# EAGLE design EAGLE FILE (EAGLE 6.6.0)
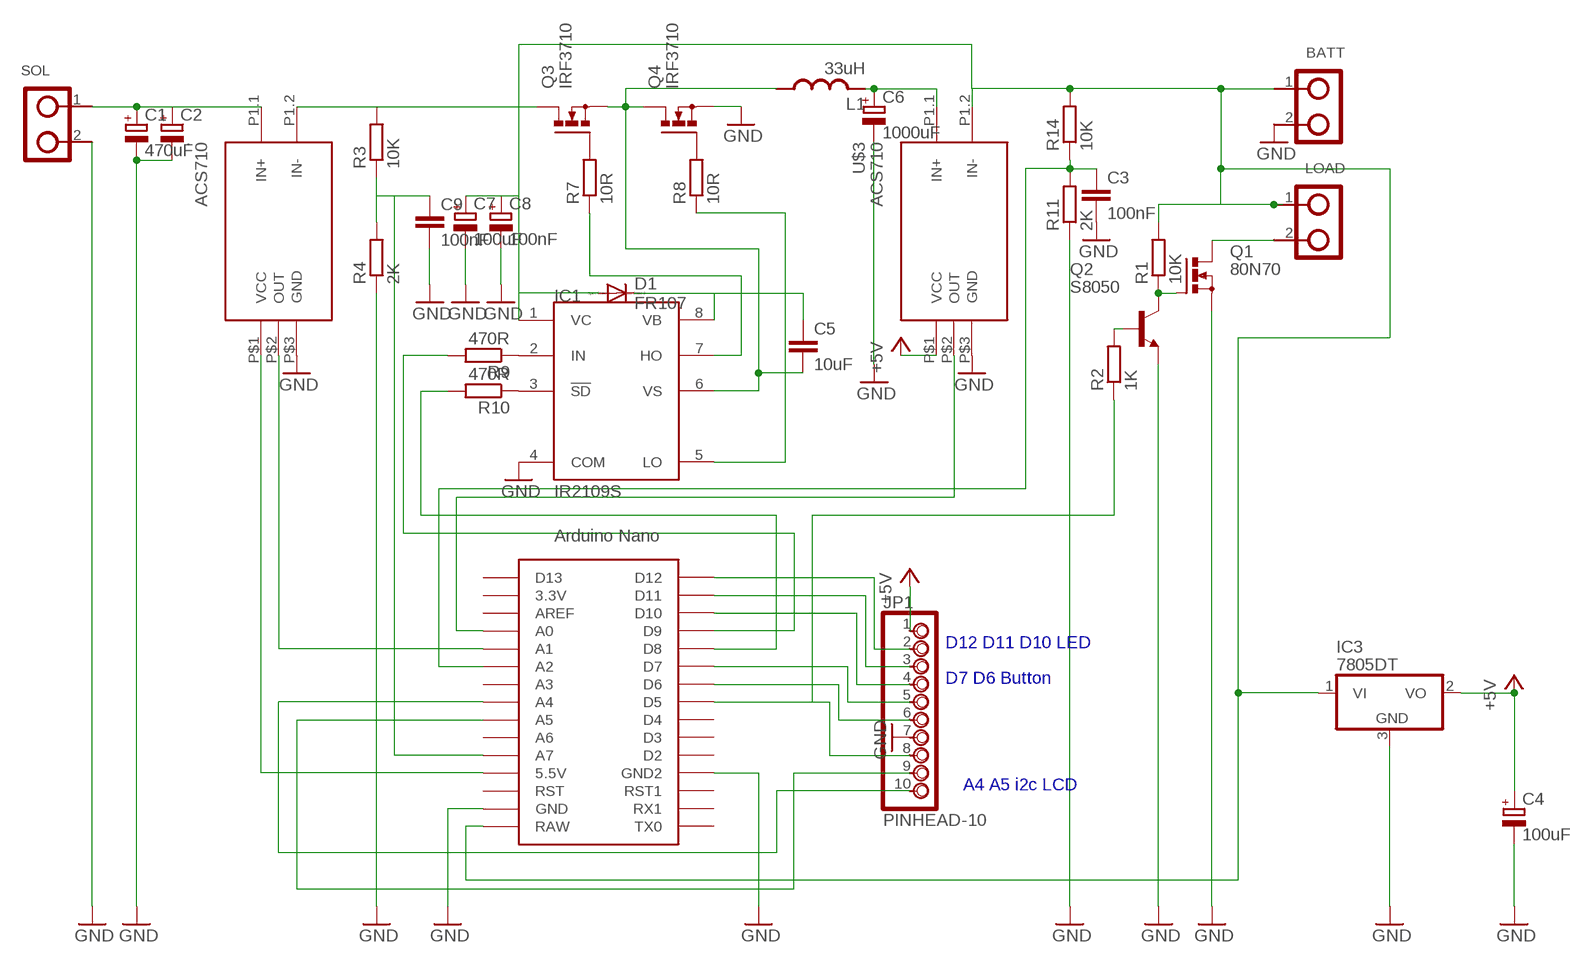
[diagram p0: schematic, sheet 1]

## Parts
.  ACS710  CURRENT-SENSOR-ACS712#IC  [CURRENT-SENSOR-ACS712#IC]
BATT  DOMINO-2  [DOMI-2]
C1  470uF  CPOL-EUE5-13  [E5-13]
C2  CPOL-EUE5-13  [E5-13]
C3  100nF  C-EUC1206  [C1206]
C4  100uF  CPOL-EUSMCD  [SMC_D]
C5  10uF  C-EUC1812  [C1812]
C6  1000uF  CPOL-EUE5-13  [E5-13]
C7  100uF  CPOL-EUSMCD  [SMC_D]
C8  100nF  CPOL-EUSMCD  [SMC_D]
C9  100nF  C-EUC1206  [C1206]
D1  FR107  DIODE-SMB  [SMB]
IC1  IR2109S  [SO08]
IC3  7805DT  [TO252]
JP1  PINHEAD-10  [PINHEAD-10]
L1  33uH  L-10  [L-10]
LOAD  DOMINO-2  [DOMI-2]
Q1  80N70  IRF512  [TO220BV]
Q2  S8050  2N4416  [TO92]
Q3  IRF3710  IRF512  [TO220BV]
Q4  IRF3710  IRF512  [TO220BV]
R1  10K  R-EU_R1206  [R1206]
R2  1K  R-EU_R1206  [R1206]
R3  10K  R-EU_R1206  [R1206]
R4  2K  R-EU_R1206  [R1206]
R7  10R  R-EU_R1206  [R1206]
R8  10R  R-EU_R1206  [R1206]
R9  470R  R-EU_R1206  [R1206]
R10  470R  R-EU_R1206  [R1206]
R11  2K  R-EU_R1206  [R1206]
R14  10K  R-EU_R1206  [R1206]
SOL  DOMINO-2  [DOMI-2]
U$1  NANO  [NANO]
U$3  ACS710  CURRENT-SENSOR-ACS712#IC  [CURRENT-SENSOR-ACS712#IC]

## Nets
+5V: C4.+ IC3.2(VO) JP1.1 U$3.P$1(VCC)
GND: ..P$3(GND) BATT.2 C1.- C2.- C3.2 C4.- C6.- C7.- C8.- C9.2 IC1.4(COM) IC3.3(GND) JP1.7 Q1.S Q2.3(E) Q4.S R4.1 R11.1 SOL.2 U$1.GND U$1.GND1(GND2) U$3.P$3(GND)
N$1: ..P$1(VCC) U$1.5V(5.5V)
N$2: LOAD.2 Q1.D
N$3: Q1.G Q2.1(C) R1.1
N$4: Q2.2(B) R2.2
N$5: JP1.8 R2.1 U$1.D5
N$6: ..P1.1(IN+) C1.+ C2.+ SOL.1
N$7: ..P1.2(IN-) Q3.D R3.2
N$8: ..P$2(OUT) U$1.A1
N$10: C9.1 R3.1 R4.2 U$1.A7
N$11: JP1.5 U$1.D7
N$12: JP1.6 U$1.D6
N$13: JP1.2 U$1.D12
N$14: JP1.3 U$1.D11
N$15: JP1.4 U$1.D10
N$17: Q3.G R7.2
N$18: Q4.G R8.2
N$19: IC1.7(HO) R7.1
N$20: IC1.5(LO) R8.1
N$21: IC1.2(IN) R9.1
N$22: IC1.3(!SD) R10.1
N$23: R9.2 U$1.D9
N$24: R10.2 U$1.D8
N$25: U$1.A0 U$3.P$2(OUT)
N$26: C3.1 R11.2 R14.1 U$1.A2
N$27: C6.+ L1.2 U$3.P1.1(IN+)
N$31: JP1.10 U$1.A4
N$32: JP1.9 U$1.A5
VB: C5.1 D1.C IC1.8(VB)
VCCS: BATT.1 C7.+ C8.+ D1.A IC1.1(VC) IC3.1(VI) LOAD.1 R1.2 R14.2 U$1.RAW U$3.P1.2(IN-)
VS: C5.2 IC1.6(VS) L1.1 Q3.S Q4.D
Unconnected: U$1.3.3V U$1.A3 U$1.A6 U$1.AREF U$1.D2 U$1.D3 U$1.D4 U$1.D13 U$1.RST U$1.RST1 U$1.RX1 U$1.TX0

## Notes on the sheet
- D12 D11 D10 LED
- D7 D6 Button
- A4 A5 i2c LCD

## Library data of the parts
. U$3 = diy-modules:CURRENT-SENSOR-ACS712#IC: Isolated Bipolar Current Sensors based on ACS712 chip Symbol with input pins More details available here: http://embedded-lab.com/blog/a-brief-overview-of-allegro-acs712-current-sensor-part-1/ Click here to find device on ebay.com <http://www.ebay.com/sch/acs712+module> Note: There are many available versions with different pinout. Please check before use
BATT LOAD SOL = HungLBR:DOMINO-2
C1 C2 C6 = lbr:CPOL-EU: POLARIZED CAPACITOR, European symbol
C3 C5 C9 = rcl:C-EU: CAPACITOR, European symbol
C4 C7 C8 = rcl:CPOL-EU: POLARIZED CAPACITOR, European symbol
D1 = diode:DIODE-: DIODE
IC1 = irs:IR2109
IC3 = chuong:78*: Positive VOLTAGE REGULATOR Source: http://cache.national.com/ds/LM/LM78L05.pdf http://www.fairchildsemi.com/ds/LM/LM7805.pdf
JP1 = chuong:PINHEAD-10
L1 = lbr:L-10
Q1 Q3 = chuong:IRF512: N-CHANNEL MOS FET
Q2 = lbr:2N4416: NPN Transistor
Q4 = lbr:IRF512: N-CHANNEL MOS FET
R1-R4 R7-R11 R14 = rcl:R-EU_: RESISTOR, European symbol
U$1 = Arduino-clone:NANO: Arduino Nano

## Board
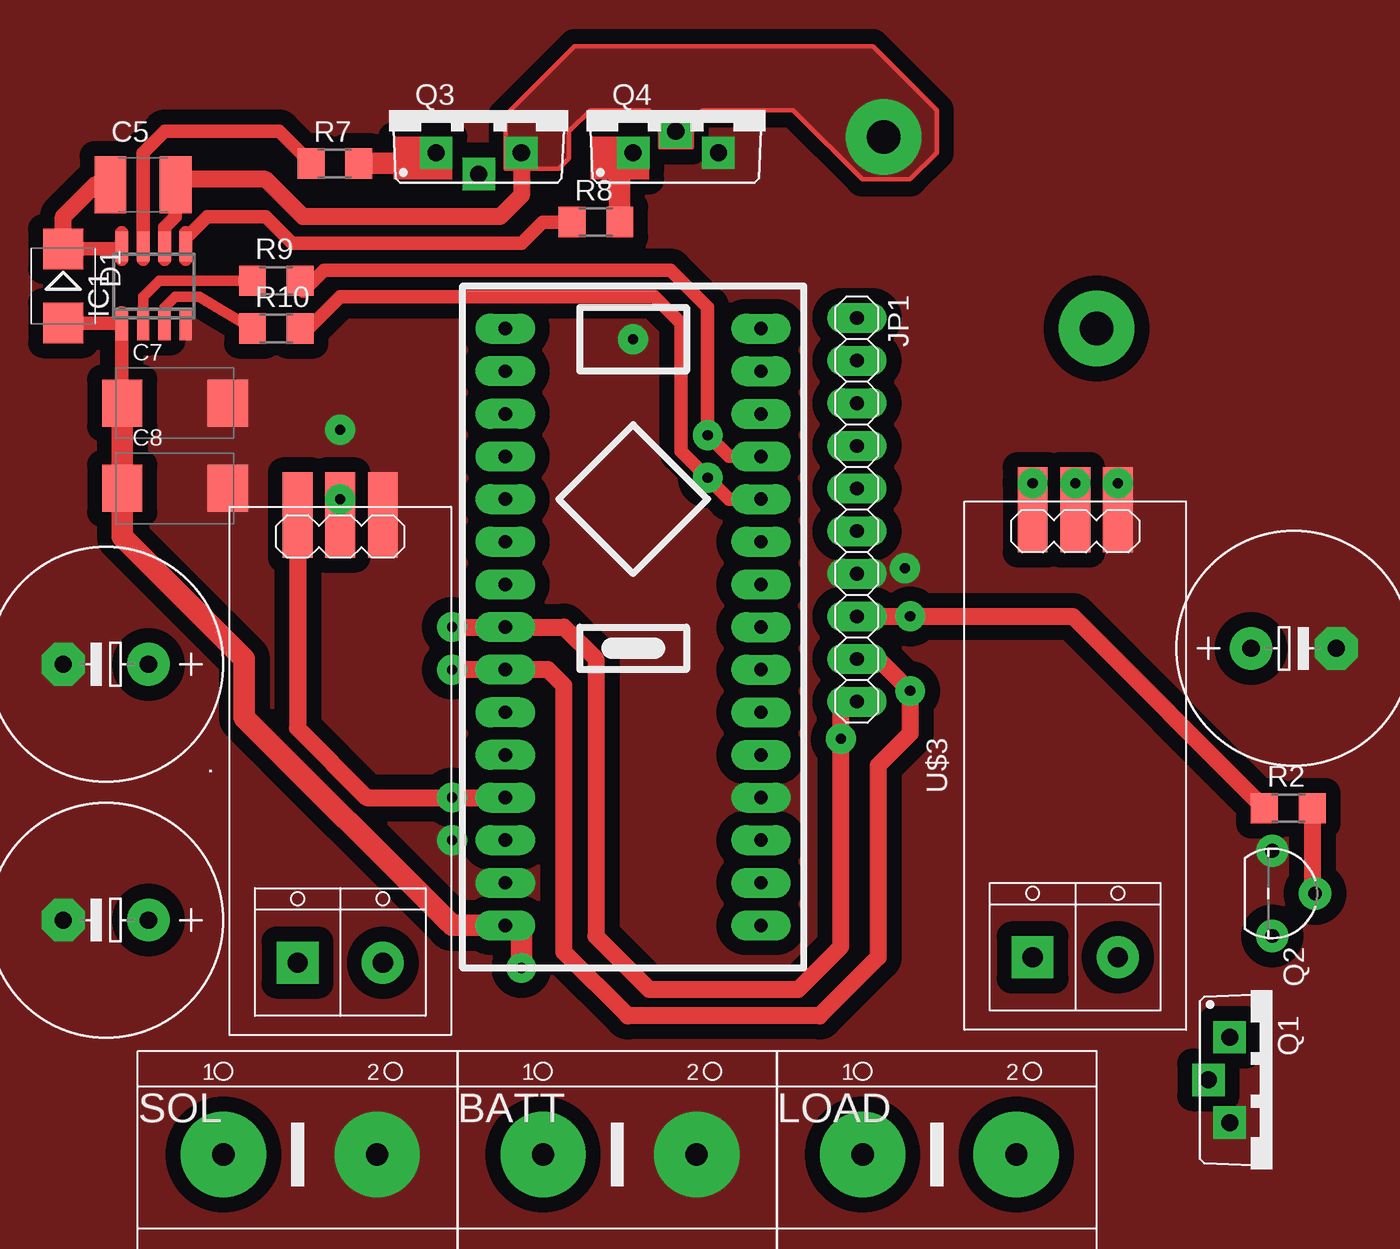
[diagram p1: board, top side]
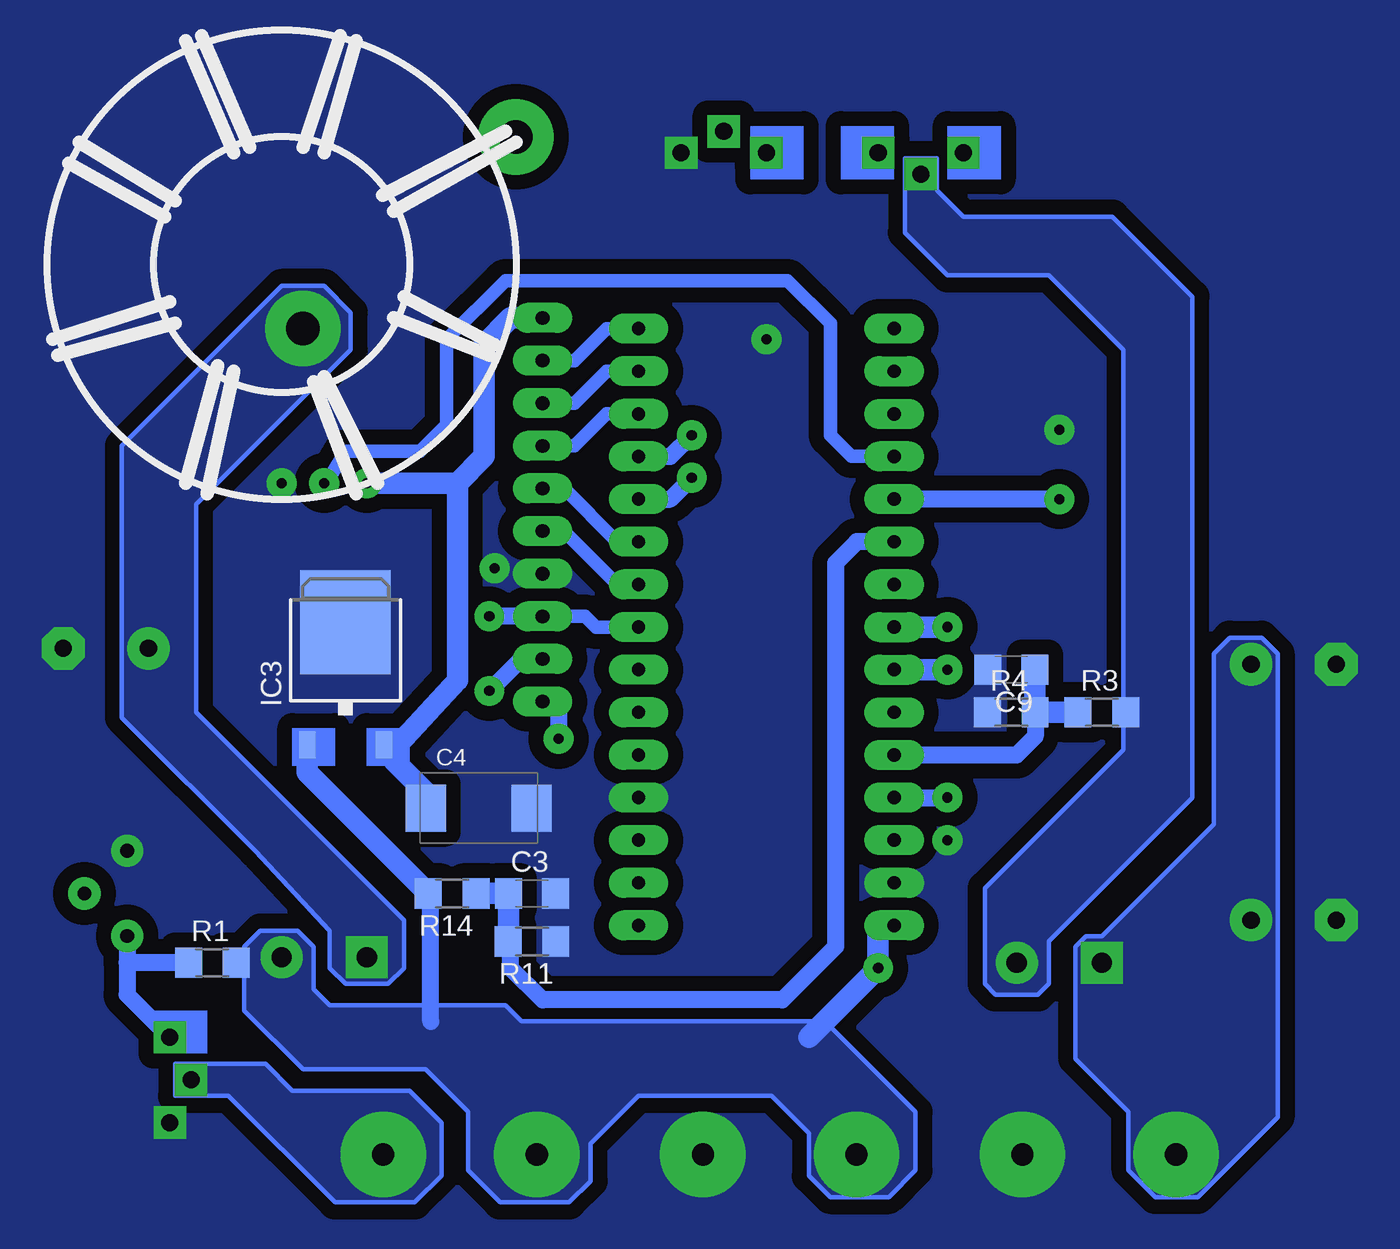
[diagram p2: board, bottom side, seen from below]

No outline drawn. Coordinates in mm, seen from the top.
Copper layers (1*16): Top 0.035mm / dielectric 1.5mm / Bottom 0.035mm
Design rules "default": minimum track width 10mil, minimum drill 24mil, track to track 8mil, track to pad 8mil, pad to pad 8mil, via to via 8mil, smd to smd 8mil, copper to edge 40mil, drill to drill 8mil, minimum pad ring 10mil, minimum via ring 8mil, stop-mask expansion 4mil, vias tented up to drill 0mil, thermal gap 10mil

### Footprints (pad centres in the part's own frame; a part is rotated, then mirrored left to right if it is on the bottom)
CURRENT-SENSOR-ACS712#IC = drill 1.2 pad 2.5 square: P1.1 -11.43,2.54 | drill 1.2 pad 2.5: P1.2 -11.43,-2.54 | smd 5.08 x 1.778: P$1 15.24,2.54; P$2 15.24,0; P$3 15.24,-2.54
DOMI-2 = drill 1.321 pad 5.08: 1 0.025,2.54; 2 9.182,2.54
E5-13 = drill 1.016 pad 2.54: + -2.54,0 | drill 1.016 pad 2.54 octagon: - 2.54,0
C1206 = smd 1.6 x 1.8: 1 -1.4,0; 2 1.4,0
SMC_D = smd 2.4 x 2.8: + -3.15,0; - 3.15,0
C1812 = smd 1.9 x 3.4: 1 -1.95,0; 2 1.95,0
SMB = smd 2.4 x 2.4: A 2.2,0; C -2.2,0
SO08 = smd 0.72 x 1.78: 1 -1.905,-2.35; 2 -0.635,-2.35; 3 0.635,-2.35; 4 1.905,-2.35; 5 1.905,2.35; 6 0.635,2.35; 7 -0.635,2.35; 8 -1.905,2.35
TO252 = smd 1 x 1.6: 1 -2.28,-4.8; 2 2.28,-4.8 | smd 5.4 x 6.2: 3 0,2.5
PINHEAD-10 = drill 0.813 pad 1.778 long: 1 -10.16,0; 2 -7.62,0; 3 -5.08,0; 4 -2.54,0; 5 0,0; 6 2.54,0; 7 5.08,0; 8 7.62,0; 9 10.16,0; 10 12.7,0
L-10 = drill 2 pad 4.5: 1 13.97,7.62; 2 1.27,-3.81
TO220BV = drill 1.016 pad 1.93 square: D 0,-3.81; G -2.54,-2.54; S 2.54,-2.54
TO92 = drill 0.813 pad 1.93: 1 2.54,0; 2 0,2.54; 3 -2.54,0
TO220BV' = drill 1.016 pad 1.93 square: D 0,-1.27; G -2.54,-2.54; S 2.54,-2.54
R1206 = smd 1.6 x 1.803: 1 -1.422,0; 2 1.422,0
NANO = drill 0.8 pad 1.778 long: 3.3V -10.16,24.13; 5V -10.16,-1.27; A0 -10.16,19.05; A1 -10.16,16.51; A2 -10.16,13.97; A3 -10.16,11.43; A4 -10.16,8.89; A5 -10.16,6.35; A6 -10.16,3.81; A7 -10.16,1.27; AREF -10.16,21.59; D2 5.08,1.27; D3 5.08,3.81; D4 5.08,6.35; D5 5.08,8.89; D6 5.08,11.43; D7 5.08,13.97; D8 5.08,16.51; D9 5.08,19.05; D10 5.08,21.59; D11 5.08,24.13; D12 5.08,26.67; D13 -10.16,26.67; GND -10.16,-6.35; GND1 5.08,-1.27; RAW -10.16,-8.89; RST -10.16,-3.81; RST1 5.08,-3.81; RX1 5.08,-6.35; TX0 5.08,-8.89

### Placement (x,y rotation side)
.  56.52,54.61 90 top
BATT  68.58,29.21 0 top
C1  42.55,45.72 180 top
C2  42.55,60.96 180 top
C3  87.95,47.31 0 bottom
C4  91.12,52.39 0 bottom
C5  44.77,89.53 0 top
C6  113.35,61.91 0 top
C7  46.67,76.52 0 top
C8  46.67,71.44 0 top
C9  59.37,60.64 180 bottom
D1  40.01,83.5 270 top
IC1  45.4,83.5 0 top
IC3  99.06,60.96 0 bottom
JP1  87.31,71.44 270 top
L1  102.87,84.77 0 bottom
LOAD  87.63,29.21 0 top
Q1  112.08,36.2 270 top
Q2  112.08,47.31 270 top
Q3  64.77,93.98 0 top
Q4  IRF3710  [TO220BV']  76.52,93.98 0 top
R1  107,43.18 0 bottom
R2  113.03,52.39 0 top
R3  53.98,58.1 0 bottom
R4  59.37,58.1 0 bottom
R7  56.2,90.81 0 top
R8  71.75,87.31 0 top
R9  52.7,83.82 0 top
R10  52.7,80.96 0 top
R11  87.95,44.45 180 bottom
R14  92.71,47.31 180 bottom
SOL  49.53,29.21 0 top
U$1  76.52,54.29 0 top
U$3  100.33,54.93 90 top

### Tracks (layer width: path | path; a pad name or v marks a point on that pad's centre or on a via)
+5V  (via drill 0.6 pad 1.78)
  Top 1.27: v97.79,71.75 U$3.P$1
  Bottom 1.27: 92.39,71.75 92.39,60.01 95.92,56.16 IC3.2 96.2,55.58 96.2,55.24 94.27,53.31 C4.+ | JP1.1 89.22,81.6 90.81,80.01 90.81,73.34 92.39,71.75 | v97.79,71.75 92.39,71.75
GND  (via drill 0.6 pad 1.78)
  other vias: 102.87,71.75 56.52,74.93 63.18,50.48 73.98,80.33 90.17,66.67
  pour Top (isolate 0.889, no thermals): 35.56,102.23 120.02,102.23 120.02,24.13 35.56,24.13
  pour Bottom (isolate 0.889, no thermals): 35.56,102.23 120.02,102.23 120.02,24.13 35.56,24.13
N$1  (via drill 0.6 pad 1.78)
  Top 1.016: ..P$1 53.98,57.15 58.1,53.02 v63.18,53.02 U$1.5V
  Bottom 1.016: U$1.5V v63.18,53.02 62.87,53.02
N$2
  Bottom 0.254: 94.93,28.89 93.34,30.48 93.34,33.66 95.25,35.56 102.23,35.56 103.82,37.15 109.22,37.15 109.22,35.24 106.05,35.24 99.69,28.89 94.93,28.89
  pour Bottom (no thermals): 109.22,37.15 103.82,37.15 102.23,35.56 95.25,35.56 93.34,33.66 93.34,30.48 94.93,28.89 99.69,28.89 106.05,35.24 109.22,35.24
N$3
  Bottom 1.016: Q2.1 112.08,43.18 | 112.08,43.18 112.08,41.27 Q1.G | R1.1 112.08,43.18
N$4
  Top 1.016: R2.2 114.45,47.47 Q2.2
N$5  (via drill 0.6 pad 1.78)
  Top 1.016: JP1.8 v90.49,63.82 100.18,63.82 R2.1
  Bottom 0.813: U$1.D5 84.14,63.18 84.77,63.82 JP1.8
  Bottom 1.016: JP1.8 v90.49,63.82
N$6
  Bottom 0.254: 43.5,61.59 43.5,33.97 48.26,29.21 50.8,29.21 52.39,30.8 52.39,34.29 55.56,37.47 55.56,44.13 54.93,44.77 53.98,44.77 47.31,51.44 47.31,61.59 46.35,62.55 44.45,62.55 43.5,61.59
  pour Bottom (no thermals): 44.45,62.55 43.5,61.59 43.5,33.97 48.26,29.21 50.8,29.21 52.39,30.8 52.39,34.29 55.56,37.47 55.56,44.13 54.93,44.77 53.98,44.77 47.31,51.44 47.31,61.59 46.35,62.55
N$7
  Bottom 0.254: 57.15,44.45 48.58,53.02 48.58,82.87 53.34,87.63 62.23,87.63 63.82,89.22 63.82,91.12 65.72,91.12 65.72,86.68 63.18,84.14 57.15,84.14 52.7,79.69 52.7,55.88 60.96,47.62 60.96,41.91 60.33,41.27 57.78,41.27 57.15,41.91 57.15,44.45
  pour Bottom (no thermals): 57.15,44.45 48.58,53.02 48.58,82.87 53.34,87.63 62.23,87.63 63.82,89.22 63.82,91.12 65.72,91.12 65.72,86.68 63.18,84.14 57.15,84.14 52.7,79.69 52.7,55.88 60.96,47.62 60.96,41.91 60.33,41.27 57.78,41.27 57.15,41.91
N$8  (via drill 0.6 pad 1.78)
  Top 1.016: ..P$2 v56.52,70.8
  Bottom 1.016: v56.52,70.8 U$1.A1
N$10
  Bottom 1.016: U$1.A7 59.05,55.56 57.95,56.67 R4.2
  Bottom 1.27: R3.1 R4.2 57.97,58.12 C9.1
N$11
  Bottom 0.813: U$1.D7 82.87,68.26 86.04,71.44 JP1.5
N$12
  Bottom 0.813: U$1.D6 82.87,65.72 86.04,68.9 JP1.6
N$13
  Bottom 0.813: U$1.D12 83.5,80.96 85.41,79.06 JP1.2
N$14
  Bottom 0.813: U$1.D11 83.5,78.42 85.41,76.52 JP1.3
N$15
  Bottom 0.813: U$1.D10 83.5,75.88 85.41,73.98 JP1.4
N$17
  Top 1.27: Q3.G 62.23,90.65 62.08,90.81 R7.2
N$18
  Top 1.27: R8.2 73.18,91.28 73.34,91.44 Q4.G
N$19
  Top 0.813: 44.77,85.09 IC1.7 44.77,91.44 46.04,92.71 52.87,92.71 R7.1
N$20
  Top 0.813: 47.31,85.09 IC1.5 47.31,86.36 | 47.31,86.36 47.31,86.68 | 47.31,86.36 48.58,87.63 52.07,87.63 53.66,86.04 67.31,86.04 68.58,87.31 R8.1
N$21
  Top 0.635: IC1.2 44.77,82.87 45.72,83.82 R9.1
N$22
  Top 0.635: IC1.3 46.04,82.23 46.67,82.87 48.11,82.87 R10.1
N$23  (via drill 0.6 pad 1.78)
  Top 0.813: R9.2 54.29,83.19 55.56,84.45 76.2,84.45 78.42,82.23 v78.42,74.61 79.69,73.34 U$1.D9
  Bottom 1.016: U$1.D9 79.69,73.34 v78.42,74.61
N$24  (via drill 0.6 pad 1.78)
  Top 0.813: R10.2 54.29,80.64 56.52,82.87 75.25,82.87 76.83,81.28 76.83,73.66 v78.42,72.07 79.69,70.8 U$1.D8
  Bottom 1.016: U$1.D8 79.69,70.8 v78.42,72.07
N$25  (via drill 0.6 pad 1.78)
  Top 1.27: U$3.P$2 v100.33,71.75
  Bottom 0.813: U$1.A0 68.9,73.34 70.17,74.61 70.17,81.28 72.71,83.82 89.53,83.82 93.03,80.33 93.03,75.25 94.61,73.66 99.06,73.66 100.01,72.07 v100.33,71.75
N$26
  Bottom 1.016: U$1.A2 68.58,68.26 69.85,66.99 69.85,44.13 73.03,40.96 87.31,40.96 89.22,42.86 89.22,44.3 R11.2
  Bottom 1.27: R11.2 89.35,44.47 C3.1 R14.1
N$27
  Bottom 0.254: 95.57,42.86 95.57,45.72 107.95,58.1 107.95,70.48 98.74,79.69 98.74,81.92 100.33,83.5 102.87,83.5 112.39,73.98 112.39,57.78 104.46,49.85 100.01,45.09 100.01,42.86 99.06,41.91 96.52,41.91 95.57,42.86
  pour Bottom (no thermals): 95.57,45.72 107.95,58.1 107.95,70.48 98.74,79.69 98.74,81.92 100.33,83.5 102.87,83.5 112.39,73.98 112.39,57.78 104.46,49.85 100.33,45.4 100.01,45.09 100.01,42.86 99.06,41.91 96.52,41.91 95.57,42.86
N$31  (via drill 0.6 pad 1.78)
  Top 1.016: JP1.10 86.36,58.74 v86.36,56.52 86.36,44.13 83.82,41.59 74.93,41.59 71.75,44.77 71.75,61.28 69.85,63.18 U$1.A4 v63.18,63.18
  Bottom 1.016: 86.36,56.83 86.36,58.74 JP1.10 | 86.36,56.83 86.68,56.52 v86.36,56.52 86.36,56.83
  Bottom 1.27: v63.18,63.18 U$1.A4
N$32  (via drill 0.6 pad 1.78)
  Top 1.016: JP1.9 88.58,61.28 v90.49,59.37 90.49,56.83 88.58,54.93 88.58,43.5 85.09,40.01 73.66,40.01 69.85,43.81 69.85,59.69 68.9,60.64 U$1.A5 v63.18,60.64
  Bottom 1.016: JP1.9 88.58,61.28 v90.49,59.37
  Bottom 1.27: v63.18,60.64 U$1.A5
VB
  Top 0.406: 40.16,85.85 40.01,85.85 40.01,86.36
  Top 0.635: 40.16,85.85 D1.C | 40.2,85.85 40.01,86.04
  Top 0.813: 43.5,86.68 IC1.8 43.5,85.72 | 43.5,85.09 43.5,85.72 | 43.5,85.72 40.03,85.72 D1.C
  Top 1.016: 40.01,86.04 40.01,86.36 40.01,87.63 41.91,89.53 C5.1
VCCS  (via drill 0.6 pad 1.78)
  Top 0.813: 43.5,81.28 43.5,81.92 | 43.5,81.28 IC1.1 43.5,76.54 C7.+ | 43.5,81.28 40.03,81.28 D1.A | 51.44,57.15 63.02,45.56 63.18,45.4
  Top 1.016: U$1.RAW 67.31,45.4
  Top 1.27: 67.31,45.4 v67.31,42.86 | C7.+ C8.+ 43.52,68.56 50.8,61.28 50.8,57.78 63.02,45.56 | 63.18,45.4 U$1.RAW
  Bottom 0.254: 71.44,30.48 70.17,29.21 66.67,29.21 65.09,30.8 65.09,34.29 70.48,39.69 88.58,39.69 89.53,40.64 93.98,40.64 100.01,40.64 100.97,41.59 100.97,44.13 101.92,45.09 104.14,45.09 105.09,44.13 105.09,40.32 101.6,36.83 94.3,36.83 91.76,34.29 91.76,30.8 89.85,28.89 85.72,28.89 84.45,30.16 84.45,32.38 81.6,35.24 73.66,35.24 71.44,33.02 71.44,30.48
  Bottom 1.016: IC3.1 101.34,55.78 | 93.98,39.69 93.98,40.64 93.98,47.16 R14.2
  Bottom 1.27: U$1.RAW 67.31,45.4 v67.31,42.86 71.44,38.73 | 101.34,55.78 101.34,54.52 R14.2
  pour Bottom (no thermals): 71.44,33.02 71.44,30.48 70.17,29.21 66.67,29.21 65.09,30.8 65.09,34.29 70.48,39.69 88.58,39.69 89.53,40.64 100.01,40.64 100.97,41.59 100.97,44.13 101.92,45.09 104.14,45.09 105.09,44.13 105.09,40.32 101.6,36.83 94.3,36.83 91.76,34.29 91.76,30.8 89.85,28.89 85.72,28.89 84.45,30.16 84.45,32.38 81.6,35.24 73.66,35.24
VS
  Top 0.254: 66.36,90.49 69.53,90.49 70.17,91.12 70.17,92.71 71.44,93.98 74.93,93.98 75.56,93.34 75.56,91.76 77.47,91.76 77.47,93.34 78.11,93.98 83.5,93.98 87.63,89.85 90.49,89.85 92.08,91.44 92.08,93.98 88.27,97.79 70.48,97.79 66.36,93.66 66.36,90.49
  Top 0.813: 46.04,85.09 IC1.6 46.04,87 46.67,87.63 46.67,89.49 C5.2
  Top 1.016: Q3.S 67.31,88.9 66.04,87.63 54.29,87.63 52.07,89.85 47.03,89.85 C5.2
  pour Top (no thermals): 66.36,90.49 69.53,90.49 70.17,91.12 70.17,92.71 71.44,93.98 74.93,93.98 75.56,93.34 75.56,91.76 77.47,91.76 77.47,93.34 78.11,93.98 83.5,93.98 87.63,89.85 90.49,89.85 92.08,91.44 92.08,93.98 88.27,97.79 70.48,97.79 66.36,93.66
(copper drawn outside any net)
  shapes: Bottom area x6, Top area x2